# Altium project voltage_monitor.PrjPcb
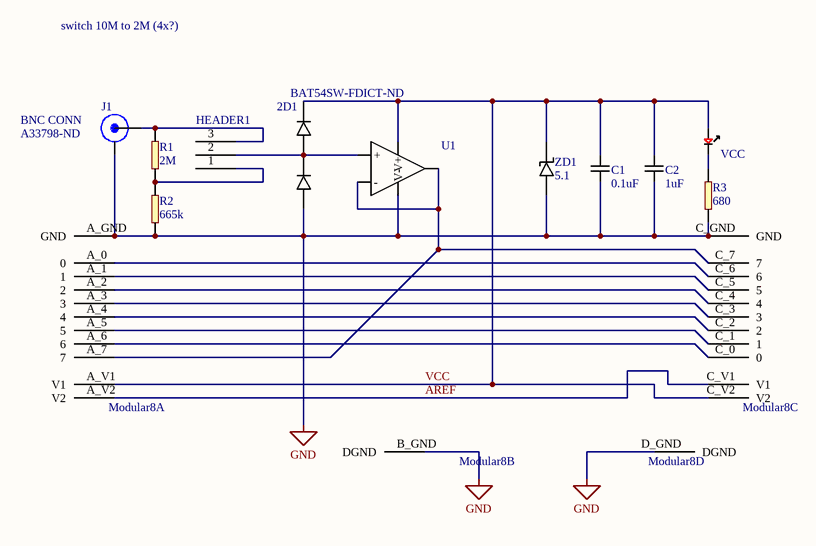
[diagram p0: voltage_monitor_rev_1.SchDoc]
1 sheet, 12 parts. Net scope: global (net labels, ports and power ports of the same name join across sheets).
Board file: voltage_monitor_003.PcbDoc

## Sheet voltage_monitor_rev_1.SchDoc
size A

### Parts
2D1  Supplier Part Number 1: BAT54SW-FDICT-ND  [SOT-23-3]  (hidden comment: BAT54SW-FDICT)
C1  C: 0.1uF  [0603]  (hidden comment: Capacitor)
C2  C: 1uF  [0603]  (hidden comment: Capacitor)
HEADER1  3x1  [3x1 THRU HOLES 0.1" PITCH]  (value not drawn)
J1  BNC CONN  Supplier Part Number 1: A33798-ND  [BNC THROUGH HOLE]
Modular8  modular8_rev2_A&C  [modular8 edges A & C]  (value not drawn)  (parts A,B,C,D of 4)
R1  R: 2M  [0603]  (hidden comment: R 2M 1%)
R2  R: 665k  [0603]  (hidden comment: R 665k 1%)
R3  R: 680  [0603]  (hidden comment: Resistor)
U1  MCP6001  [SOT-23-5]  (value not drawn)
VCC  LEDY  [0805 - LED]  (value not drawn)
ZD1  Voltage: 5.1  [SOD-323F]  (hidden comment: Zener 5.1V)

### Nets
GND: 2D1.1 C1.2 C2.2 J1.1(G) Modular8.A_GND(GND) Modular8.B_GND(DGND) Modular8.C_GND(GND) Modular8.D_GND(DGND) R2.2 R3.2 U1.2(V-) ZD1.2
AREF: Modular8.A_V2(V2) Modular8.C_V1(V1)
VCC: 2D1.2 C1.1 C2.1 Modular8.A_V1(V1) Modular8.C_V2(V2) U1.5(V+) VCC.1(A) ZD1.1
Net2D1_3: 2D1.3 HEADER1.2 U1.3(+)
NetHEADER1_1: HEADER1.1 R1.2 R2.1
NetHEADER1_3: HEADER1.3 J1.2(S) R1.1
NetModular8_A_0: Modular8.A_0(0) Modular8.C_6(6)
NetModular8_A_1: Modular8.A_1(1) Modular8.C_5(5)
NetModular8_A_2: Modular8.A_2(2) Modular8.C_4(4)
NetModular8_A_3: Modular8.A_3(3) Modular8.C_3(3)
NetModular8_A_4: Modular8.A_4(4) Modular8.C_2(2)
NetModular8_A_5: Modular8.A_5(5) Modular8.C_1(1)
NetModular8_A_6: Modular8.A_6(6) Modular8.C_0(0)
NetModular8_A_7: Modular8.A_7(7) Modular8.C_7(7) U1.1(OUT) U1.4(-)
NetR3_1: R3.1 VCC.2(K)

### Notes on the sheet
- switch 10M to 2M (4x?)

### Library data of the parts
J1 = A33798: Supplier 1: Digi-Key
2D1 = BAT54SW-FDICT: Supplier 1: Digi-Key
C1 C2 = Capacitor: Supplier 1: Digi-Key; Supplier Part Number 1: 445-9015-6-ND; Supplier Part Number 2: 490-1524-2-ND; Supplier 2: Digi-Key; Supplier 3: Digi-Key; Supplier Part Number 3: 445-1273-1-ND
R1 = R 2M 1%: Supplier 1: Digi-Key; Supplier Part Number 1: 311-2.00MHRCT-ND
R2 = R 665k 1%: Supplier 1: Digi-Key; Supplier Part Number 1: 311-665KHRCT-ND
R3 = Resistor: Supplier 1: Digi-Key; Supplier Part Number 1: LVK12R020DERDKR-ND; Supplier 2: Digi-Key; Supplier 3: Digi-Key; Supplier Part Number 2: 311-10.0KHRCT-ND; Supplier Part Number 3: 311-100KHRCT-ND; Supplier 4: Digi-Key; Supplier Part Number 4: RHM0.0GCT-ND; Supplier 5: Digi-Key; Supplier 6: Digi-Key; Supplier Part Number 5: 311-200KHRCT-ND; Supplier Part Number 6: LVK12R010DERCT-ND; Supplier 7: Digi-Key; Supplier 8: Digi-Key; Supplier Part Number 7: 311-300KHRCT-ND; Supplier Part Number 8: 311-330GRCT-ND
U1 = MCP6001: Supplier 1: Digi-Key; Supplier Part Number 1: MCP6001UT-I/OTCT-ND
VCC = LEDY: Supplier 1: Digi-Key; Supplier Part Number 1: 160-1413-1-ND
ZD1 = Zener 5.1V: Supplier 1: Digi-Key; Supplier Part Number 1: UDZ5V1BF-7DICT-ND